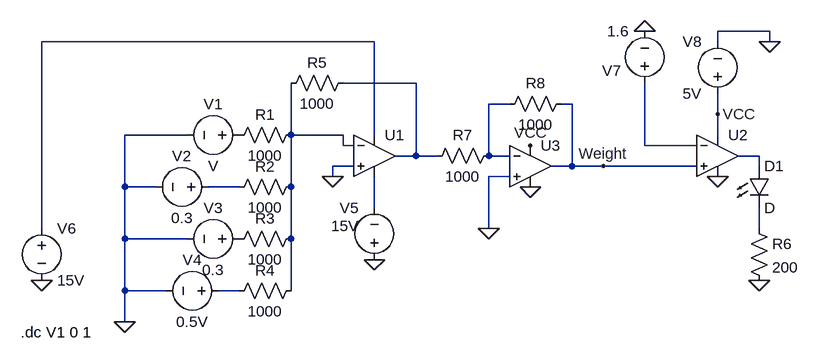
[diagram p0: schematic Wieghing_Machine(+weight).asc]
Wieghing_Machine(+weight).asc, the LTspice schematic file:
Version 4
SHEET 1 1040 680
WIRE 784 -48 704 -48
WIRE 176 -32 -336 -32
WIRE 704 -32 704 -48
WIRE 784 -32 784 -48
WIRE 240 32 128 32
WIRE 384 64 352 64
WIRE 480 64 464 64
WIRE 704 80 704 48
WIRE -112 112 -208 112
WIRE 48 112 48 32
WIRE 128 112 48 112
WIRE 176 112 176 -32
WIRE 704 112 704 80
WIRE 128 128 128 112
WIRE 144 128 128 128
WIRE 592 128 592 32
WIRE 672 128 592 128
WIRE 240 144 240 32
WIRE 240 144 208 144
WIRE 272 144 240 144
WIRE 352 144 352 64
WIRE 384 144 352 144
WIRE 768 144 736 144
WIRE 144 160 112 160
WIRE 480 160 480 64
WIRE 480 160 448 160
WIRE 528 160 480 160
WIRE 672 160 528 160
WIRE 768 160 768 144
WIRE 112 176 112 160
WIRE 384 176 352 176
WIRE -208 192 -208 112
WIRE -160 192 -208 192
WIRE -32 192 -80 192
WIRE 48 192 48 112
WIRE 176 224 176 176
WIRE -336 256 -336 -32
WIRE 352 256 352 176
WIRE 768 256 768 224
WIRE -208 272 -208 192
WIRE -112 272 -208 272
WIRE 48 272 48 192
WIRE -208 352 -208 272
WIRE -144 352 -208 352
WIRE -32 352 -64 352
WIRE 48 352 48 272
WIRE -208 400 -208 352
FLAG 112 176 0
FLAG 176 304 0
FLAG -336 336 0
FLAG 592 -48 0
FLAG 704 176 0
FLAG 784 -32 0
FLAG 768 336 0
FLAG -208 400 0
FLAG 352 256 0
FLAG 416 128 VCC
FLAG 704 80 VCC
FLAG 416 192 0
FLAG 528 160 Weight
SYMBOL res 64 96 R90
WINDOW 0 0 56 VBottom 2
WINDOW 3 32 56 VTop 2
SYMATTR InstName R1
SYMATTR Value 1000
SYMBOL res 64 176 R90
WINDOW 0 0 56 VBottom 2
WINDOW 3 32 56 VTop 2
SYMATTR InstName R2
SYMATTR Value 1000
SYMBOL res 64 256 R90
WINDOW 0 0 56 VBottom 2
WINDOW 3 32 56 VTop 2
SYMATTR InstName R3
SYMATTR Value 1000
SYMBOL res 64 336 R90
WINDOW 0 0 56 VBottom 2
WINDOW 3 32 56 VTop 2
SYMATTR InstName R4
SYMATTR Value 1000
SYMBOL voltage -16 112 R90
WINDOW 0 -32 56 VBottom 2
WINDOW 3 32 56 VTop 2
SYMATTR InstName V1
SYMBOL voltage -64 192 R90
WINDOW 0 -32 56 VBottom 2
WINDOW 3 32 56 VTop 2
WINDOW 123 0 0 Left 0
WINDOW 39 0 0 Left 0
SYMATTR InstName V2
SYMATTR Value 0.3
SYMBOL voltage -16 272 R90
WINDOW 0 -32 56 VBottom 2
WINDOW 3 32 56 VTop 2
WINDOW 123 0 0 Left 0
WINDOW 39 0 0 Left 0
SYMATTR InstName V3
SYMATTR Value 0.3
SYMBOL voltage -48 352 R90
WINDOW 0 -32 56 VBottom 2
WINDOW 3 32 56 VTop 2
WINDOW 123 0 0 Left 0
WINDOW 39 0 0 Left 0
SYMATTR InstName V4
SYMATTR Value 0.5V
SYMBOL Opamps\\UniversalOpamp2 176 144 R0
SYMATTR InstName U1
SYMBOL voltage 176 320 R180
WINDOW 0 24 96 Left 2
WINDOW 3 24 68 Left 2
WINDOW 123 0 0 Left 0
WINDOW 39 0 0 Left 0
SYMATTR InstName V5
SYMATTR Value 15V
SYMBOL voltage -336 240 R0
WINDOW 123 0 0 Left 0
WINDOW 39 0 0 Left 0
SYMATTR InstName V6
SYMATTR Value 15V
SYMBOL res 144 16 R90
WINDOW 0 0 56 VBottom 2
WINDOW 3 32 56 VTop 2
SYMATTR InstName R5
SYMATTR Value 1000
SYMBOL Opamps\\UniversalOpamp2 704 144 R0
SYMATTR InstName U2
SYMBOL LED 752 160 R0
SYMATTR InstName D1
SYMBOL voltage 704 64 R180
WINDOW 0 24 96 Left 2
WINDOW 3 24 16 Left 2
WINDOW 123 0 0 Left 0
WINDOW 39 0 0 Left 0
SYMATTR InstName V8
SYMATTR Value 5V
SYMBOL res 752 240 R0
SYMATTR InstName R6
SYMATTR Value 200
SYMBOL Opamps\\UniversalOpamp2 416 160 R0
SYMATTR InstName U3
SYMBOL res 368 128 R90
WINDOW 0 0 56 VBottom 2
WINDOW 3 32 56 VTop 2
SYMATTR InstName R7
SYMATTR Value 1000
SYMBOL res 480 48 R90
WINDOW 0 0 56 VBottom 2
WINDOW 3 32 56 VTop 2
SYMATTR InstName R8
SYMATTR Value 1000
SYMBOL voltage 592 48 R180
WINDOW 0 36 35 Left 2
WINDOW 123 0 0 Left 0
WINDOW 39 0 0 Left 0
SYMATTR InstName V7
SYMATTR Value 1.6
TEXT -368 416 Left 2 !.dc V1 0 1

The netlist it stands for:
* Wieghing_Machine(+weight).asc
R1 N004 P001 1000
R2 N004 N007 1000
R3 N004 P002 1000
R4 N004 N010 1000
V1 P001 0 V
V2 N007 0 0.3
V3 P002 0 0.3
V4 N010 0 0.5V
XU1 0 N004 N001 N008 N002 level.2 Avol=1Meg GBW=10Meg Slew=10Meg ilimit=25m rail=0 Vos=0 phimargin=45 en=0 enk=0 in=0 ink=0 Rin=500Meg  ; pins IN+ IN- V+ V- OUT
V5 0 N008 15V
V6 N001 0 15V
R5 N002 N004 1000
XU2 Weight N005 VCC 0 N006 level.2 Avol=1Meg GBW=10Meg Slew=10Meg ilimit=25m rail=0 Vos=0 phimargin=45 en=0 enk=0 in=0 ink=0 Rin=500Meg  ; pins IN+ IN- V+ V- OUT
D1 N006 N009 D
V8 VCC 0 5V
R6 N009 0 200
XU3 0 N003 VCC 0 Weight level.2 Avol=1Meg GBW=10Meg Slew=10Meg ilimit=25m rail=0 Vos=0 phimargin=45 en=0 enk=0 in=0 ink=0 Rin=500Meg  ; pins IN+ IN- V+ V- OUT
R7 N003 N002 1000
R8 Weight N003 1000
V7 N005 0 1.6
.model D D
.lib standard.dio
.dc V1 0 1
.lib UniversalOpamps2.sub
.backanno
.end